# Altium project LOGI-PI.PrjPcb (part 2 of 2)

## Sheet POWER_SUPPLY.SchDoc: Power Supply
size B; Engineer: M. Jones; Organization: Michael Jones; DocumentNumber: 2; Revision: RA.1; SheetNumber: 2; SheetTotal: 7
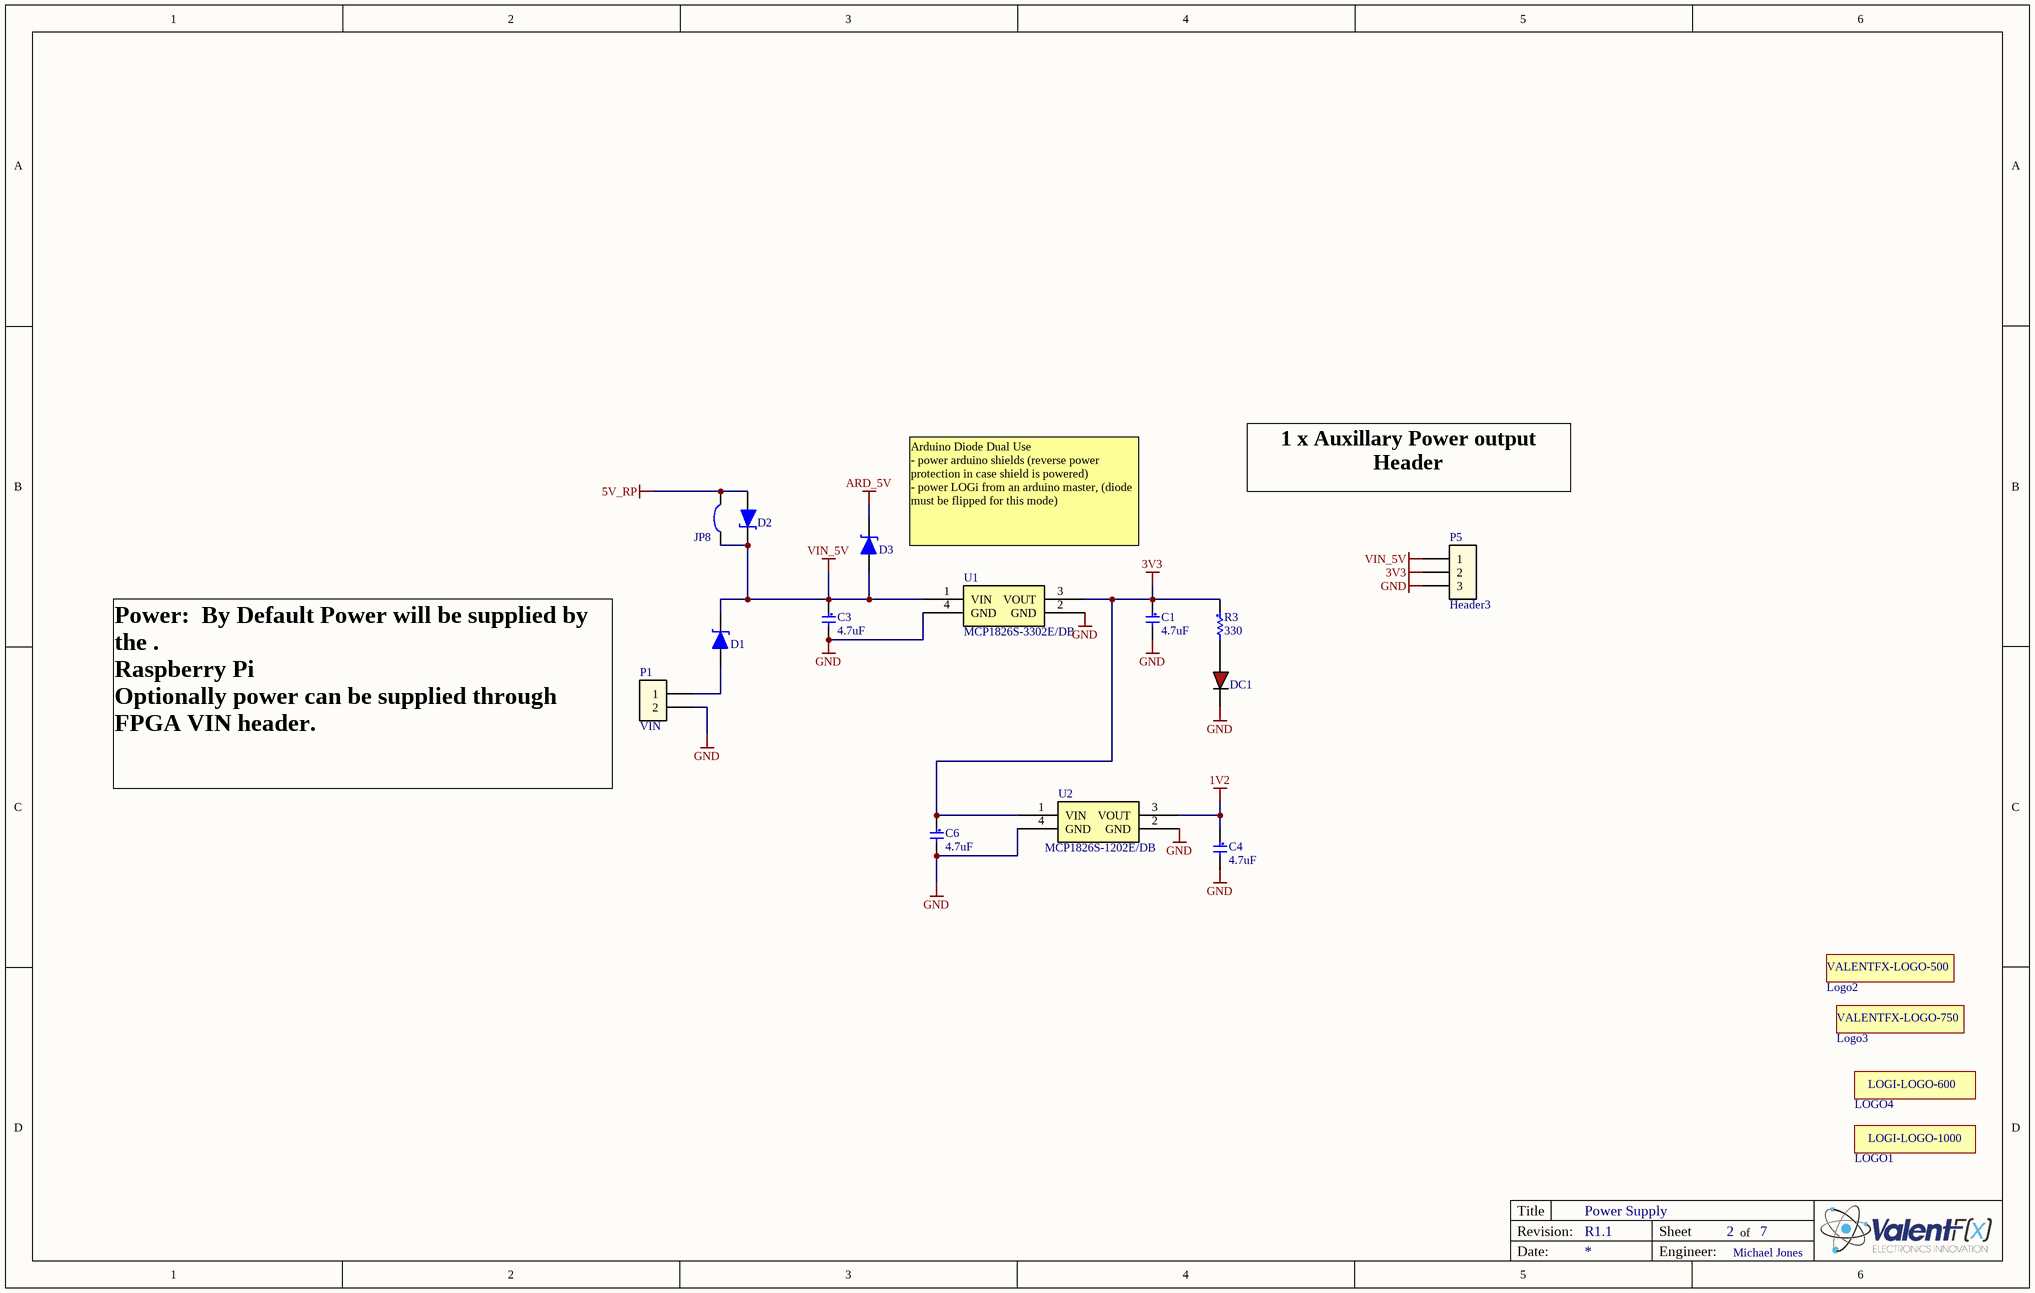
[diagram p5: POWER_SUPPLY.SchDoc]

### Parts
C1  4.7uF  [C0603 - Marked]
C3  4.7uF  [C0603 - Marked]
C4  4.7uF  [C0603 - Marked]
C6  4.7uF  [C0603 - Marked]
D1  RB161M-20TR  [SOD-123]  (value not drawn)
D2  RB161M-20TR  [SOD-123]  (value not drawn)
D3  RB161M-20TR  [SOD-123]  (value not drawn)
DC1  598-8010-107F  [LED_0603 - RED]  (value not drawn)
JP8  Solder Jumper  [SOLDER_JUMPER]  (value not drawn)  (no BOM)
LOGO1  LOGI-1000  [LOGI-1000-SILK]  (value not drawn)  (no BOM)
Logo2  Valent Logo 500  [VALENTFX_500-SolderMask]  (value not drawn)  (no BOM)
Logo3  Valent Logo 750  [VALENTFX_750-SolderMask]  (value not drawn)  (no BOM)
LOGO4  LOGI-600  [LOGI-600-SILK]  (value not drawn)  (no BOM)
P1  VIN  [HEADER_2_40_100 THRU SIP]  (no BOM)
P5  Header3  [HEADER_3_40_100 THRU SIP]  (no BOM)
R3  330  [R0603]
U1  MCP1826S-3302E/DB  [SOT223]
U2  MCP1826S-1202E/DB  [SOT223]

### Nets
1V2: C4.1 U2.3(VOUT)
3V3: C1.1 C6.1 P5.2 R3.1 U1.3(VOUT) U2.1(VIN)
5V_RP: D2.2(A) JP8.1
ARD_5V: D3.1(C)
GND: C1.2 C3.2 C4.2 C6.2 DC1.C P1.2 P5.3 U1.2(GND) U1.4(GND) U2.2(GND) U2.4(GND)
VIN_5V: C3.1 D1.1(C) D2.1(C) D3.2(A) JP8.2 P5.1 U1.1(VIN)
NetD1_2: D1.2(A) P1.1
NetDC1_A: DC1.A R3.2

### Notes on the sheet
- 1 x Auxillary Power output Header
- Arduino Diode Dual Use
  - power arduino shields (reverse power protection in case shield is powered)
  - power LOGi from an arduino master, (diode must be flipped for this mode)
- Power:  By Default Power will be supplied by the .
  Raspberry Pi
  Optionally power can be supplied through FPGA VIN header.
- Title
- Revision:
- Sheet
- of
- Date:
- Engineer:
- (in symbol LOGI-600) LOGI-LOGO-600
- (in symbol LOGI-1000) LOGI-LOGO-1000
- (in symbol Valent Logo 500) VALENTFX-LOGO-500
- (in symbol Valent Logo 750) VALENTFX-LOGO-750

### Library data of the parts
C1 C3 C4 C6 = C0603 - GRM188R60J475KE19D: 4.7uF 6.3volts X5R 10% (MLCC) - SMD/SMT 0603; Manufacturer: Murata Electronics North America; Capacitance: 4.7µF; Voltage - Rated: 6.3V; Supplier 1: Digi-Key; Manufacturer Part Number: GRM188R60J475KE19D; RoHS: RoHS Compliant; Category: Capacitors; Stock 1: 614848; Pricing 1: 1=0.19, 10=0.132, 50=0.076, 100=0.0627, 250=0.05284, 500=0.04426, 1000=0.03633 (USD); Package / Case: 0603 (1608 Metric); Packaging: Cut Tape (CT); Tolerance: ±10%; ComponentLink1URL: http://search.murata.co.jp/Ceramy/image/img/PDF/ENG/GRM188R60J475KE19.pdf; ComponentLink1Description: http://search.murata.co.jp/Ceramy/image/img/PDF/ENG/GRM188R60J475KE19.pdf; Value: 4.7uF; Temperature Coefficient: X5R; Mounting Type: Surface Mount, MLCC; Operating Temperature: -55°C ~ 85°C; Applications: General Purpose; Ratings: -; Size / Dimension: 0.063" L x 0.031" W (1.60mm x 0.80mm); Height - Seated (Max): -; Thickness (Max): 0.035" (0.90mm); Lead Spacing: -; Features: -; Lead Style: -; Supplier Part Number 1: 490-3297-1-ND
D1-D3 = RB161M-20TR: DIODE SCHOTTKY 25V 1A SOD123; Source Part Number: RB161M-20CT-ND; Manufacturer: Diodes Inc; Manufacturer Part Number: Rohm Semiconductor; Voltage - Forward (Vf) (Max) @ If: 350mV @ 1A; Voltage - DC Reverse (Vr) (Max): 20V; Current - Reverse Leakage @ Vr: 700µA @ 20V; Speed: Fast Recovery =< 500ns, > 200mA (Io); Source: Digikey; Value: RB161M-20TR; Supplier 1: Digi-Key; RoHS: RoHS Compliant; Category: Discrete Semiconductor Products; Stock 1: 29589; Pricing 1: 1=0.58, 25=0.4044, 100=0.3465, 250=0.29924, 500=0.25726, 1000=0.1995 (USD); Current - Average Rectified (Io): 1A; Diode Type: Schottky; Reverse Recovery Time (trr): -; Capacitance @ Vr, F: -; Mounting Type: Surface Mount; Package / Case: SOD-123F; Supplier Device Package: PMDU; Packaging: Cut Tape (CT); ComponentLink1URL: http://www.rohm.com/products/databook/di/pdf/rb161m-20.pdf; ComponentLink1Description: http://www.rohm.com/products/databook/di/pdf/rb161m-20.pdf; Supplier Part Number 1: RB161M-20CT-ND
DC1 = LED0603 - 598-8010-107F: LED ALINGAP RED CLEAR 0603 SMD; Manufacturer: Dialight; Current - Test: 20mA; Wavelength - Dominant: 635nm; Millicandela Rating: 40mcd; Voltage - Forward (Vf) Typ: 2.2V; Lens Style/Size: Rectangle with Flat Top, 1.1mm x 0.8mm; Viewing Angle: 140°; Accept Replacement: YES - Water Clear; Supplier 1: Digi-Key; Manufacturer Part Number: 598-8010-107F; RoHS: RoHS Compliant; Category: Optoelectronics; Stock 1: 37578; Pricing 1: 1=0.45, 10=0.33, 25=0.264, 100=0.1749, 250=0.1452, 500=0.1056, 1000=0.0825 (USD); Color: Red; Luminous Flux @ Current - Test: -; Wavelength - Peak: -; Lens Type: Clear; Size / Dimension: 1.60mm L x 0.80mm W; Height: 0.70mm; Package / Case: 0603 (1608 Metric); Mounting Type: Surface Mount; Packaging: Digi-Reel®; ComponentLink1URL: http://media.digikey.com/pdf/Data%20Sheets/Dialight%20PDFs/598_Series_0603_Pkg.pdf; ComponentLink1Description: http://media.digikey.com/pdf/Data%20Sheets/Dialight%20PDFs/598_Series_0603_Pkg.pdf; Supplier Part Number 1: 350-2029-6-ND
JP8 = Solder Jumper: Solder/Configuration Jumper; Manufacturer: n/a; Manufacturer Part Number: n/a; Source: n/a; Source Part Number: n/a; ROHS Certificate: n/a
P1 = Header2: Header 2 pin
P5 = Header3: Header  pin
R3 = R0603 - ERJ-3GEYJ331V: Thick Film Resistors - SMD 0603 330ohms 5% Tol; Manufacturer: Panasonic; Temperature Coefficient: 200 PPM / C; Power Rating: 100 mW; Voltage Rating: 75 V; Manufacturer Part Number: ERJ-3GEYJ331V; Value: 330; Supplier 1: Mouser; Supplier Part Number 1: 667-ERJ-3GEYJ331V; RoHS: RoHS Compliant By Exemption; Category: Thick Film Resistors - SMD; Stock 1: 131470; Pricing 1: 1=0.108, 10=0.012, 100=0.005, 1000=0.004, 5000=0.003 (AUD); Tolerance: 5 %; Packaging: Reel; Package / Case: 0603 (1608 metric); ComponentLink1URL: http://www.mouser.com/ds/2/315/AOA0000CE1-37422.pdf; ComponentLink1Description: http://www.mouser.com/ds/2/315/AOA0000CE1-37422.pdf; Dimensions: 0.8 mm W x 1.6 mm L x 0.45 mm H; Operating Temperature Range: - 55 C to + 155 C; Product: Thick Film Resistors SMD; Resistance: 330 Ohms; Series: ERJ; Termination Style: SMD/SMT; Case Code - in: 0603; Case Code - mm: 1608; Standard Pack Qty: 5000; RoHS - Mouser: E; Minimum Order Quantity: 1; Reeling: True
U1 = REG - MCP1826S-3302E/DB: LDO REG 1A 3.3V SOT223-3; Manufacturer: Microchip Technology; Regulator Topology: Positive Fixed; Voltage - Input: Up to 6V; Voltage - Dropout (Typical): 0.25V @ 1A; Number of Regulators: 1; Current - Output: 1A (Min); Value: MCP1826S-3302E/DB; Supplier 1: Digi-Key; Supplier Part Number 1: MCP1826S-3302E/DB-ND; Manufacturer Part Number: MCP1826S-3302E/DB; RoHS: RoHS Compliant; Category: Integrated Circuits (ICs); Stock 1: 2041; Pricing 1: 1=0.74, 10=0.68, 25=0.57, 100=0.52 (USD); Voltage - Output: 3.3V; Current - Limit (Min): -; Operating Temperature: -40°C ~ 125°C; Mounting Type: Surface Mount; Package / Case: TO-261-4, TO-261AA; Supplier Device Package: SOT-223-3; Packaging: Tube; ComponentLink1URL: http://ww1.microchip.com/downloads/en/DeviceDoc/22057a.pdf; ComponentLink1Description: http://ww1.microchip.com/downloads/en/DeviceDoc/22057a.pdf
U2 = MCP1826S-1202E/DB: IC LDO REG 1A 1.2V SOT223-3; Manufacturer: Microchip Technology; Regulator Topology: Positive Fixed; Voltage - Input: Up to 6V; Voltage - Dropout (Typical): 0.25V @ 1A; Number of Regulators: 1; Current - Output: 1A (Min); Value: MCP1826S-1202E/DB; Supplier 1: Digi-Key; Supplier Part Number 1: MCP1826S-1202E/DB-ND; Manufacturer Part Number: MCP1826S-1202E/DB; RoHS: RoHS Compliant; Category: Integrated Circuits (ICs); Stock 1: 2041; Pricing 1: 1=0.74, 10=0.68, 25=0.57, 100=0.52 (USD); Voltage - Output: 1.2V; Current - Limit (Min): -; Operating Temperature: -40°C ~ 125°C; Mounting Type: Surface Mount; Package / Case: TO-261-4, TO-261AA; Supplier Device Package: SOT-223-3; Packaging: Tube; ComponentLink1URL: http://ww1.microchip.com/downloads/en/DeviceDoc/22057a.pdf; ComponentLink1Description: http://ww1.microchip.com/downloads/en/DeviceDoc/22057a.pdf

## Sheet RAM.SchDoc: SDRAM
size B; Engineer: M. Jones; Organization: Michael Jones; DocumentNumber: 7; Revision: RA.1; SheetNumber: 7; SheetTotal: 7
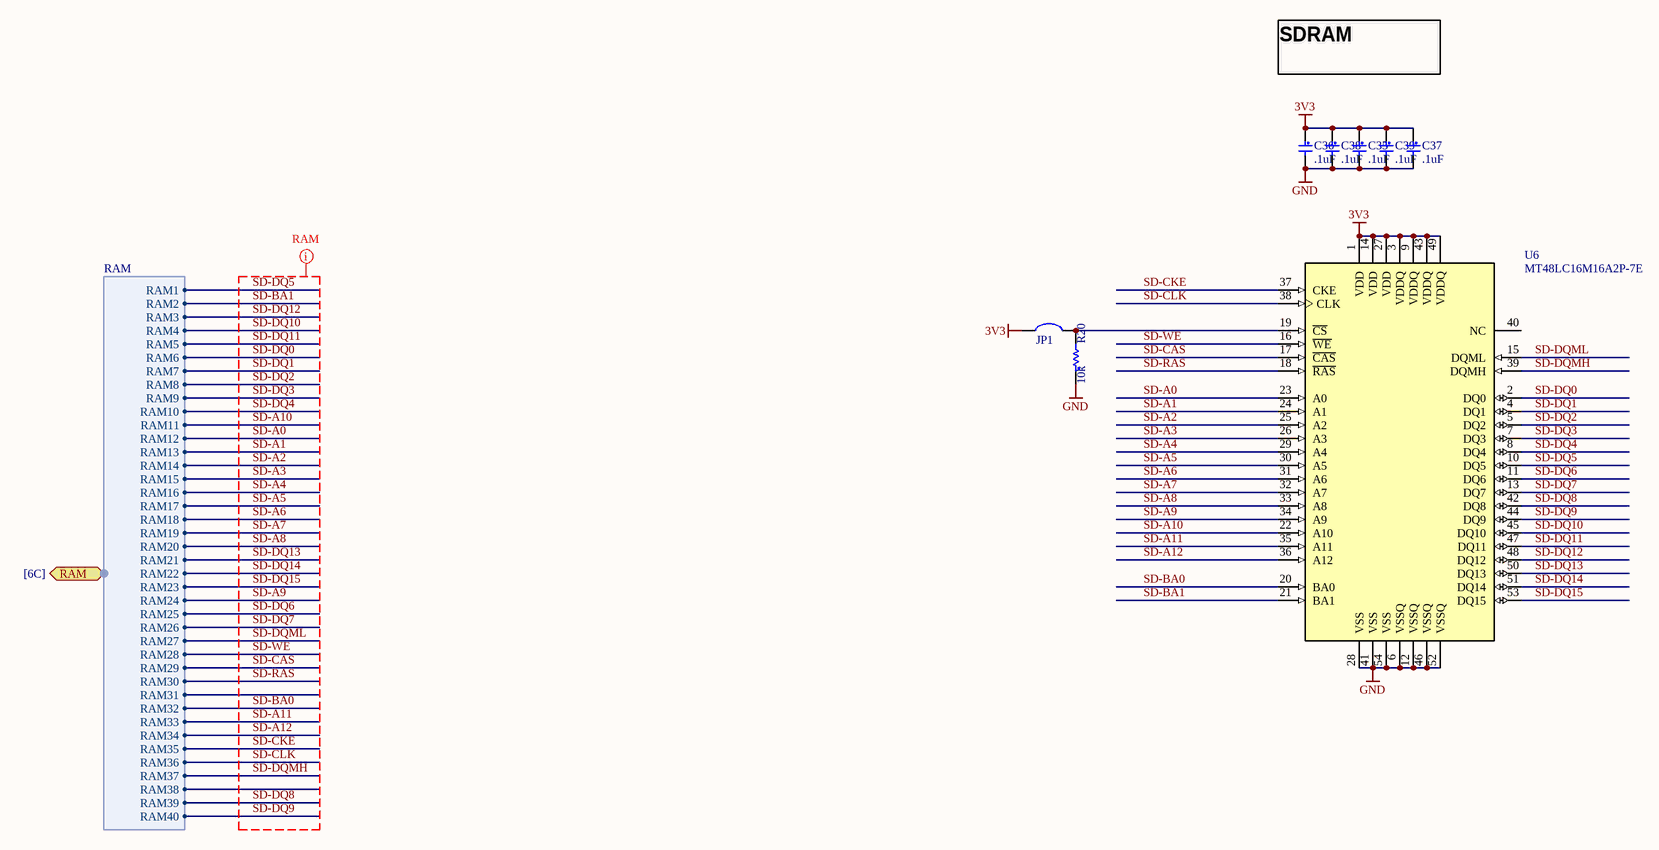
[diagram p6: RAM.SchDoc]

### Parts
C35  .1uF  [c0603]
C36  .1uF  [c0603]
C37  .1uF  [c0603]
C38  .1uF  [c0603]
C39  .1uF  [c0603]
JP1  Solder Jumper  [SOLDER_JUMPER]  (value not drawn)  (no BOM)
R20  10k  [R0603]
U6  MT48LC16M16A2P-7E  [TSOP2-54_L]

### Ports
RAM (harness RAM, see [6C])

### Harnesses
RAM: RAM1, RAM2, RAM3, RAM4, RAM5, RAM6, RAM7, RAM8, RAM9, RAM10, RAM11, RAM12, RAM13, RAM14, RAM15, RAM16, RAM17, RAM18, RAM19, RAM20, RAM21, RAM22, RAM23, RAM24, RAM25, RAM26, RAM27, RAM28, RAM29, RAM30, RAM31, RAM32, RAM33, RAM34, RAM35, RAM36, RAM37, RAM38, RAM39, RAM40

### Nets
3V3: C35.1 C36.1 C37.1 C38.1 C39.1 JP1.1 U6.1(VDD) U6.3(VDDQ) U6.9(VDDQ) U6.14(VDD) U6.27(VDD) U6.43(VDDQ) U6.49(VDDQ)
GND: C35.2 C36.2 C37.2 C38.2 C39.2 R20.1 U6.6(VSSQ) U6.12(VSSQ) U6.28(VSS) U6.41(VSS) U6.46(VSSQ) U6.52(VSSQ) U6.54(VSS)
SD-A0: U6.23(A0) ; port RAM.RAM12
SD-A1: U6.24(A1) ; port RAM.RAM13
SD-A2: U6.25(A2) ; port RAM.RAM14
SD-A3: U6.26(A3) ; port RAM.RAM15
SD-A4: U6.29(A4) ; port RAM.RAM16
SD-A5: U6.30(A5) ; port RAM.RAM17
SD-A6: U6.31(A6) ; port RAM.RAM18
SD-A7: U6.32(A7) ; port RAM.RAM19
SD-A8: U6.33(A8) ; port RAM.RAM20
SD-A9: U6.34(A9) ; port RAM.RAM24
SD-A10: U6.22(A10) ; port RAM.RAM11
SD-A11: U6.35(A11) ; port RAM.RAM33
SD-A12: U6.36(A12) ; port RAM.RAM34
SD-BA0: U6.20(BA0) ; port RAM.RAM32
SD-BA1: U6.21(BA1) ; port RAM.RAM2
SD-CAS: U6.17(~{CAS}) ; port RAM.RAM29
SD-CKE: U6.37(CKE) ; port RAM.RAM35
SD-CLK: U6.38(CLK) ; port RAM.RAM36
SD-DQ0: U6.2(DQ0) ; port RAM.RAM6
SD-DQ1: U6.4(DQ1) ; port RAM.RAM7
SD-DQ2: U6.5(DQ2) ; port RAM.RAM8
SD-DQ3: U6.7(DQ3) ; port RAM.RAM9
SD-DQ4: U6.8(DQ4) ; port RAM.RAM10
SD-DQ5: U6.10(DQ5) ; port RAM.RAM1
SD-DQ6: U6.11(DQ6) ; port RAM.RAM25
SD-DQ7: U6.13(DQ7) ; port RAM.RAM26
SD-DQ8: U6.42(DQ8) ; port RAM.RAM39
SD-DQ9: U6.44(DQ9) ; port RAM.RAM40
SD-DQ10: U6.45(DQ10) ; port RAM.RAM4
SD-DQ11: U6.47(DQ11) ; port RAM.RAM5
SD-DQ12: U6.48(DQ12) ; port RAM.RAM3
SD-DQ13: U6.50(DQ13) ; port RAM.RAM21
SD-DQ14: U6.51(DQ14) ; port RAM.RAM22
SD-DQ15: U6.53(DQ15) ; port RAM.RAM23
SD-DQMH: U6.39(DQMH) ; port RAM.RAM37
SD-DQML: U6.15(DQML) ; port RAM.RAM27
SD-RAS: U6.18(~{RAS}) ; port RAM.RAM30
SD-WE: U6.16(~{WE}) ; port RAM.RAM28
NetJP1_2: JP1.2 R20.2 U6.19(~{CS})

Not connected (* = marked no-connect by the designer): U6 40(NC)

### Layout directives
net class RAM: SD-A0, SD-A1, SD-A2, SD-A3, SD-A4, SD-A5, SD-A6, SD-A7, SD-A8, SD-A9, SD-A10, SD-A11, SD-A12, SD-BA0, SD-BA1, SD-CAS, SD-CKE, SD-CLK, SD-DQ0, SD-DQ1, SD-DQ2, SD-DQ3, SD-DQ4, SD-DQ5, SD-DQ6, SD-DQ7, SD-DQ8, SD-DQ9, SD-DQ10, SD-DQ11, SD-DQ12, SD-DQ13, SD-DQ14, SD-DQ15, SD-DQMH, SD-DQML, SD-RAS, SD-WE

### Notes on the sheet
- SDRAM
- Title
- Revision:
- Sheet
- of
- Date:
- Engineer:

### Library data of the parts
C35-C39 = C0603 - CL10F104ZA8NNNC: CAP CER 0.1UF 25V Y5V 0603; Manufacturer: Samsung Electro-Mechanics America, Inc; Capacitance: 0.1µF; Tolerance: -20%, +80%; Temperature Coefficient: Y5V (F); Accept Alternative: Yes; Supplier 1: Digi-Key; Manufacturer Part Number: CL10F104ZA8NNNC; RoHS: RoHS Compliant; Category: Capacitors; Stock 1: 400907; Pricing 1: 1=0.1, 10=0.017, 25=0.012, 50=0.009, 100=0.0076, 250=0.00624, 500=0.00536, 1000=0.00417 (USD); Package / Case: 0603 (1608 Metric); Packaging: Cut Tape (CT); ComponentLink1URL: http://www.samsungsem.com/servlet/FileDownload?type=spec&file=CL10F104ZA8NNNC.pdf; ComponentLink1Description: http://www.samsungsem.com/servlet/FileDownload?type=spec&file=CL10F104ZA8NNNC.pdf; Supplier Part Number 1: 1276-1011-1-ND; Value: .1uF; Voltage - Rated: 25V; Mounting Type: Surface Mount, MLCC; Operating Temperature: -30°C ~ 85°C; Applications: General Purpose; Ratings: -; Size / Dimension: 0.063" L x 0.031" W (1.60mm x 0.80mm); Height - Seated (Max): -; Thickness (Max): 0.035" (0.90mm); Lead Spacing: -; Features: -; Lead Style: -
JP1 = Solder Jumper: Solder/Configuration Jumper; Manufacturer: n/a; Manufacturer Part Number: n/a; Source: n/a; Source Part Number: n/a; ROHS Certificate: n/a
R20 = R0603 - CRCW060310K0FKEA: 10k Thick Film Resistors - SMD 1/10watt 10Kohms 1%; Manufacturer: Vishay Dale; Power (Watts): 0.1W, 1/10W; Temperature Coefficient: ±100ppm/°C; Manufacturer Part Number: CRCW060310K0FKEA; Value: 10k; Supplier 1: Digi-Key; RoHS: RoHS Compliant; Category: Resistors; Stock 1: 997856; Pricing 1: 10=0.081, 50=0.0436, 200=0.0251, 1000=0.01711 (USD); Resistance (Ohms): 10K; Composition: Thick Film; Features: -; Tolerance: ±1%; Size / Dimension: 0.061" L x 0.033" W (1.55mm x 0.85mm); Height: 0.020" (0.50mm); Packaging: Cut Tape (CT); Package / Case: 0603 (1608 Metric); ComponentLink1URL: http://www.vishay.com/doc?20035; ComponentLink1Description: http://www.vishay.com/doc?20035; Supplier Part Number 1: 541-10.0KHCT-ND; Number of Terminations: 2
U6 = SDRAM - MT48LC16M16A2P-7E: 256Mb Synchronous High-Speed CMOS DRAM, 16Mb x 16Bit x 4 Banks, 54-Pin TSOP Pb-free, Commercial; Manufacturer: MICRON; Manufacturer Part Number: MT48LC16M16A2P-7E IT:G; Supplier 1: Avnet; RoHS: YES; Stock 1: 662; Pricing 1: 1=6.65, 100=4.68, 1000=4.22 (USD); ComponentLink1URL: http://avnetexpress.avnet.com/store/em/EMController?langId=-1&storeId=500201&catalogId=500201&term=mt48lc16m16a2p&x=-860&y=-339&searchType=&advAction=&N=0&Ne=100000&action=products; ComponentLink1Description: http://avnetexpress.avnet.com/store/em/EMController?langId=-1&storeId=500201&catalogId=500201&term=mt48lc16m16a2p&x=-860&y=-339&searchType=&advAction=&N=0&Ne=100000&action=products; Supplier Part Number 1: MT48LC16M16A2P-7E IT:G; Value: MT48LC16M16A2P-7E

## Nets that join several sheets
1V2: FPGA_POWER_AND_CONFIGURATION (10 pins), POWER_SUPPLY (C4.1 U2.3)
3V3: DIGITAL_IO (12 pins), FPGA_POWER_AND_CONFIGURATION (47 pins), LOGIC_FPGA (C8.1 U4.1 U4.4), PERIPHERAL_PORT_IO (PA1.A2 PA1.A4 R11.2 R12.2), POWER_SUPPLY (6 pins), RAM (13 pins)
5V_RP: PERIPHERAL_PORT_IO (P2.2 P2.4), POWER_SUPPLY (D2.2 JP8.1)
ARD_5V: PERIPHERAL_PORT_IO (PA1.A5), POWER_SUPPLY (D3.1)
GND: DIGITAL_IO (19 pins), FPGA_POWER_AND_CONFIGURATION (47 pins), LOGIC_FPGA (C8.2 U4.2), PERIPHERAL_PORT_IO (9 pins), POWER_SUPPLY (11 pins), RAM (13 pins)
ARD_MISO_D12: LOGIC_FPGA (U3.87), PERIPHERAL_PORT_IO (PA4.D5)
ARD_MOSI_D11: LOGIC_FPGA (U3.51), PERIPHERAL_PORT_IO (PA4.D4)
ARD_SCK_D13: LOGIC_FPGA (U3.84), PERIPHERAL_PORT_IO (PA4.D6)
ARD_SS_D10: FPGA_POWER_AND_CONFIGURATION (U3.74), PERIPHERAL_PORT_IO (PA4.D3)
FLASH_CS_ARD_D8: FPGA_POWER_AND_CONFIGURATION (R19.1 U3.38 U5.1), PERIPHERAL_PORT_IO (PA4.D1)
FLASH_SDI_ARD_D9: FPGA_POWER_AND_CONFIGURATION (U3.64 U5.5), PERIPHERAL_PORT_IO (PA4.D2)
LED0_ARD_D6: DIGITAL_IO (R9.2), LOGIC_FPGA (U3.105), PERIPHERAL_PORT_IO (JP10.1)
LED1_ARD_D7: DIGITAL_IO (R6.2), LOGIC_FPGA (U3.104), PERIPHERAL_PORT_IO (JP9.1)
PB0: DIGITAL_IO (C5.1 PB0.B R2.2), FPGA_POWER_AND_CONFIGURATION (JP5.2), LOGIC_FPGA (U3.102)
PB1: DIGITAL_IO (C2.1 PB1.B R1.2), LOGIC_FPGA (U3.101)
PMOD1_1_: DIGITAL_IO (J1.1), LOGIC_FPGA (U3.5)
PMOD1_1_: DIGITAL_IO (J2.1), LOGIC_FPGA (U3.142)
PMOD1_2_: DIGITAL_IO (J1.2), LOGIC_FPGA (U3.2)
PMOD1_2_: DIGITAL_IO (J2.2), LOGIC_FPGA (U3.141)
PMOD1_3_: DIGITAL_IO (J1.3), LOGIC_FPGA (U3.1)
PMOD1_3_: DIGITAL_IO (J2.3), LOGIC_FPGA (U3.15)
PMOD1_4_: DIGITAL_IO (J1.4), LOGIC_FPGA (U3.16)
PMOD1_4_: DIGITAL_IO (J2.4), LOGIC_FPGA (U3.14)
PMOD1_7_ARD_D2: DIGITAL_IO (J1.7), LOGIC_FPGA (U3.88)
PMOD1_7_ARD_D2: DIGITAL_IO (J2.7), LOGIC_FPGA (U3.144), PERIPHERAL_PORT_IO (PA3.C3)
PMOD1_8_ARD_D3: DIGITAL_IO (J1.8), LOGIC_FPGA (U3.92)
PMOD1_8_ARD_D3: DIGITAL_IO (J2.8), LOGIC_FPGA (U3.143), PERIPHERAL_PORT_IO (PA3.C4)
PMOD1_9_ARD_D4: DIGITAL_IO (J1.9), LOGIC_FPGA (U3.93)
PMOD1_9_ARD_D4: DIGITAL_IO (J2.9), LOGIC_FPGA (U3.140), PERIPHERAL_PORT_IO (PA3.C5)
PMOD1_10_ARD_D5: DIGITAL_IO (J1.10), LOGIC_FPGA (U3.94)
PMOD1_10_ARD_D5: DIGITAL_IO (J2.10), LOGIC_FPGA (U3.139), PERIPHERAL_PORT_IO (PA3.C6)
PMOD3_1_DIFF7_P: DIGITAL_IO (J3.1), LOGIC_FPGA (U3.138)
PMOD3_2_DIFF7_N: DIGITAL_IO (J3.2), LOGIC_FPGA (U3.137)
PMOD3_3_DIFF5_P: DIGITAL_IO (J3.3), LOGIC_FPGA (U3.124)
PMOD3_4_DIFF5_N: DIGITAL_IO (J3.4), LOGIC_FPGA (U3.123)
PMOD3_7_DIFF8_P: DIGITAL_IO (J3.7), LOGIC_FPGA (U3.119)
PMOD3_8_DIFF8_N: DIGITAL_IO (J3.8), LOGIC_FPGA (U3.118)
PMOD3_9_DIFF6_P: DIGITAL_IO (J3.9), LOGIC_FPGA (U3.117)
PMOD3_10_DIFF6_N: DIGITAL_IO (J3.10), LOGIC_FPGA (U3.116)
PMOD4_1_DIFF3_P: DIGITAL_IO (J4.1), LOGIC_FPGA (U3.112)
PMOD4_2_DIFF3_N: DIGITAL_IO (J4.2), LOGIC_FPGA (U3.111)
PMOD4_3_DIFF1_P: DIGITAL_IO (J4.3), LOGIC_FPGA (U3.132)
PMOD4_4_DIFF1_N: DIGITAL_IO (J4.4), LOGIC_FPGA (U3.131)
PMOD4_7_DIFF4_P: DIGITAL_IO (J4.7), LOGIC_FPGA (U3.115)
PMOD4_8_DIFF4_N: DIGITAL_IO (J4.8), LOGIC_FPGA (U3.114)
PMOD4_9_DIFF2_P: DIGITAL_IO (J4.9), LOGIC_FPGA (U3.134)
PMOD4_10_DIFF2_N: DIGITAL_IO (J4.10), LOGIC_FPGA (U3.133)
RP_GPIO_GCLK: LOGIC_FPGA (U3.95), PERIPHERAL_PORT_IO (P2.7)
RP_GPIO_GEN0_MODE1_: FPGA_POWER_AND_CONFIGURATION (JP6.1 R17.2 U3.60), PERIPHERAL_PORT_IO (P2.11)
RP_GPIO_GEN1_MODE0: FPGA_POWER_AND_CONFIGURATION (JP7.1 R14.2 U3.69), PERIPHERAL_PORT_IO (P2.12)
RP_GPIO_GEN2: LOGIC_FPGA (U3.81), PERIPHERAL_PORT_IO (P2.13)
RP_GPIO_GEN3: LOGIC_FPGA (U3.80), PERIPHERAL_PORT_IO (P2.15)
RP_GPIO_GEN4_INIT_B: FPGA_POWER_AND_CONFIGURATION (R15.1 T3.1 U3.39), PERIPHERAL_PORT_IO (P2.16)
RP_GPIO_GEN5_PROG_B: FPGA_POWER_AND_CONFIGURATION (JP5.1 P6.1 R16.1 U3.37), PERIPHERAL_PORT_IO (P2.18)
RP_GPIO_GEN6_DONE: FPGA_POWER_AND_CONFIGURATION (R10.1 T5.1 U3.71), PERIPHERAL_PORT_IO (P2.22)
RP_SPI_CE0N: LOGIC_FPGA (U3.79), PERIPHERAL_PORT_IO (P2.24)
RP_SPI_CE1N: LOGIC_FPGA (U3.78), PERIPHERAL_PORT_IO (P2.26)
SATA_D1_N: DIGITAL_IO (P3.3), LOGIC_FPGA (U3.126)
SATA_D1_P: DIGITAL_IO (P3.2), LOGIC_FPGA (U3.127)
SATA_D2_N: DIGITAL_IO (P3.5), LOGIC_FPGA (U3.120)
SATA_D2_P: DIGITAL_IO (P3.6), LOGIC_FPGA (U3.121)
SD-A0: LOGIC_FPGA (U3.30), RAM (U6.23)
SD-A1: LOGIC_FPGA (U3.32), RAM (U6.24)
SD-A2: LOGIC_FPGA (U3.33), RAM (U6.25)
SD-A3: LOGIC_FPGA (U3.34), RAM (U6.26)
SD-A4: LOGIC_FPGA (U3.35), RAM (U6.29)
SD-A5: LOGIC_FPGA (U3.40), RAM (U6.30)
SD-A6: LOGIC_FPGA (U3.41), RAM (U6.31)
SD-A7: LOGIC_FPGA (U3.43), RAM (U6.32)
SD-A8: LOGIC_FPGA (U3.44), RAM (U6.33)
SD-A9: LOGIC_FPGA (U3.45), RAM (U6.34)
SD-A10: LOGIC_FPGA (U3.29), RAM (U6.22)
SD-A11: LOGIC_FPGA (U3.46), RAM (U6.35)
SD-A12: LOGIC_FPGA (U3.47), RAM (U6.36)
SD-BA0: LOGIC_FPGA (U3.26), RAM (U6.20)
SD-BA1: LOGIC_FPGA (U3.27), RAM (U6.21)
SD-CAS: LOGIC_FPGA (U3.7), RAM (U6.17)
SD-CKE: LOGIC_FPGA (U3.48), RAM (U6.37)
SD-CLK: LOGIC_FPGA (U3.50), RAM (U6.38)
SD-DQ0: LOGIC_FPGA (U3.24), RAM (U6.2)
SD-DQ1: LOGIC_FPGA (U3.23), RAM (U6.4)
SD-DQ2: LOGIC_FPGA (U3.22), RAM (U6.5)
SD-DQ3: LOGIC_FPGA (U3.21), RAM (U6.7)
SD-DQ4: LOGIC_FPGA (U3.17), RAM (U6.8)
SD-DQ5: LOGIC_FPGA (U3.12), RAM (U6.10)
SD-DQ6: LOGIC_FPGA (U3.11), RAM (U6.11)
SD-DQ7: LOGIC_FPGA (U3.10), RAM (U6.13)
SD-DQ8: LOGIC_FPGA (U3.66), RAM (U6.42)
SD-DQ9: LOGIC_FPGA (U3.62), RAM (U6.44)
SD-DQ10: LOGIC_FPGA (U3.61), RAM (U6.45)
SD-DQ11: LOGIC_FPGA (U3.59), RAM (U6.47)
SD-DQ12: LOGIC_FPGA (U3.58), RAM (U6.48)
SD-DQ13: LOGIC_FPGA (U3.57), RAM (U6.50)
SD-DQ14: LOGIC_FPGA (U3.56), RAM (U6.51)
SD-DQ15: LOGIC_FPGA (U3.55), RAM (U6.53)
SD-DQMH: LOGIC_FPGA (U3.67), RAM (U6.39)
SD-DQML: LOGIC_FPGA (U3.9), RAM (U6.15)
SD-RAS: LOGIC_FPGA (U3.6), RAM (U6.18)
SD-WE: LOGIC_FPGA (U3.8), RAM (U6.16)
SW0: DIGITAL_IO (R7.2 SW1.A2), LOGIC_FPGA (U3.99)
SW1: DIGITAL_IO (R4.2 SW1.A1), LOGIC_FPGA (U3.100)
SYS_MISO: LOGIC_FPGA (U3.75), PERIPHERAL_PORT_IO (JP3.1 P2.21)
SYS_MOSI: FPGA_POWER_AND_CONFIGURATION (U3.65 U5.2), PERIPHERAL_PORT_IO (JP2.1 P2.19)
SYS_RX: LOGIC_FPGA (U3.82), PERIPHERAL_PORT_IO (P2.10 PA3.C1)
SYS_SCK: FPGA_POWER_AND_CONFIGURATION (U3.70 U5.6), PERIPHERAL_PORT_IO (JP4.1 P2.23)
SYS_SCL: LOGIC_FPGA (U3.97), PERIPHERAL_PORT_IO (P2.5 PA4.D10 R11.1)
SYS_SDA: LOGIC_FPGA (U3.98), PERIPHERAL_PORT_IO (P2.3 PA4.D9 R12.1)
SYS_TX: LOGIC_FPGA (U3.83), PERIPHERAL_PORT_IO (P2.8 PA3.C2)

## Assembly variants
Complete: not fitted U5
Final-MFG: not fitted C2 C5 R19